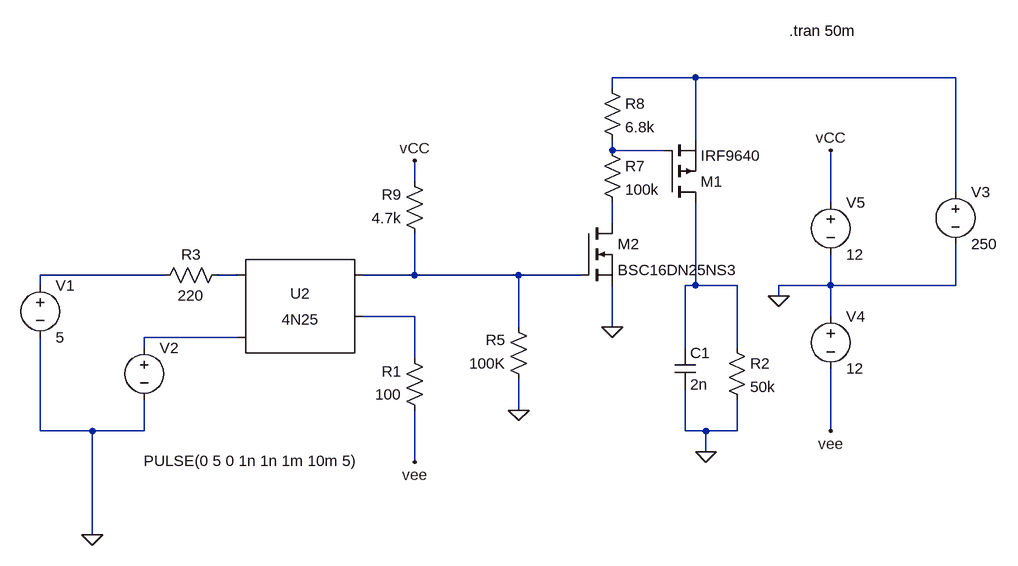
[diagram p0: schematic writePlateDriver.asc]
writePlateDriver.asc, the LTspice schematic file:
Version 4
SHEET 1 1400 848
WIRE 736 -64 608 -64
WIRE 1136 -64 736 -64
WIRE 608 -48 608 -64
WIRE 736 32 736 -64
WIRE 608 48 608 32
WIRE 688 48 608 48
WIRE 304 96 304 64
WIRE 1136 112 1136 -64
WIRE 944 128 944 48
WIRE 608 160 608 128
WIRE -80 240 -272 240
WIRE 32 240 0 240
WIRE 304 240 304 176
WIRE 304 240 224 240
WIRE 464 240 304 240
WIRE 560 240 464 240
WIRE -272 256 -272 240
WIRE 736 256 736 128
WIRE 736 256 720 256
WIRE 800 256 736 256
WIRE 944 256 944 208
WIRE 944 256 864 256
WIRE 1136 256 1136 192
WIRE 1136 256 944 256
WIRE 864 272 864 256
WIRE 304 304 224 304
WIRE 944 304 944 256
WIRE 464 320 464 240
WIRE 608 320 608 256
WIRE 32 336 -112 336
WIRE -112 352 -112 336
WIRE 720 352 720 256
WIRE 800 352 800 256
WIRE 304 368 304 304
WIRE 464 448 464 400
WIRE -272 480 -272 336
WIRE -192 480 -272 480
WIRE -112 480 -112 432
WIRE -112 480 -192 480
WIRE 720 480 720 416
WIRE 752 480 720 480
WIRE 800 480 800 432
WIRE 800 480 752 480
WIRE 944 480 944 384
WIRE 752 512 752 480
WIRE 304 528 304 448
WIRE -192 640 -192 480
FLAG 864 272 0
FLAG 944 480 vee
FLAG 944 48 vCC
FLAG 608 320 0
FLAG 752 512 0
FLAG 304 64 vCC
FLAG 304 528 vee
FLAG 464 448 0
FLAG -192 640 0
SYMBOL voltage -112 336 R0
WINDOW 3 -1 190 Left 2
SYMATTR Value PULSE(0 5 0 1n 1n 1m 10m 5)
SYMATTR InstName V2
SYMBOL res 16 224 R90
WINDOW 0 0 56 VBottom 2
WINDOW 3 32 56 VTop 2
SYMATTR InstName R3
SYMATTR Value 220
SYMBOL voltage 944 288 R0
SYMATTR InstName V4
SYMATTR Value 12
SYMBOL voltage 944 112 R0
SYMATTR InstName V5
SYMATTR Value 12
SYMATTR SpiceLine Rser=5
SYMBOL voltage 1136 96 R0
SYMATTR InstName V3
SYMATTR Value 250
SYMATTR SpiceLine Rser=5
SYMBOL nmos 560 160 R0
SYMATTR InstName M2
SYMATTR Value BSC16DN25NS3
SYMBOL res 592 32 R0
SYMATTR InstName R7
SYMATTR Value 100k
SYMBOL cap 704 352 R0
SYMATTR InstName C1
SYMATTR Value 2n
SYMBOL res 784 336 R0
SYMATTR InstName R2
SYMATTR Value 50k
SYMBOL res 592 -64 R0
SYMATTR InstName R8
SYMATTR Value 6.8k
SYMBOL pmos 688 128 M180
SYMATTR InstName M1
SYMATTR Value IRF9640
SYMBOL 4N25 128 304 R0
SYMATTR InstName U2
SYMBOL res 320 192 R180
WINDOW 0 36 76 Left 2
WINDOW 3 36 40 Left 2
SYMATTR InstName R9
SYMATTR Value 4.7k
SYMBOL res 320 464 R180
WINDOW 0 36 76 Left 2
WINDOW 3 36 40 Left 2
SYMATTR InstName R1
SYMATTR Value 100
SYMBOL res 480 416 R180
WINDOW 0 36 76 Left 2
WINDOW 3 36 40 Left 2
SYMATTR InstName R5
SYMATTR Value 100K
SYMBOL voltage -272 240 R0
SYMATTR InstName V1
SYMATTR Value 5
SYMATTR SpiceLine Rser=0
TEXT 880 -136 Left 2 !.tran 50m

The netlist it stands for:
* writePlateDriver.asc
V2 N009 0 PULSE(0 5 0 1n 1n 1m 10m 5)
R3 N005 N004 220
V4 0 vee 12
V5 vCC 0 12 Rser=5
V3 N001 0 250 Rser=5
M2 N003 N006 0 0 BSC16DN25NS3
R7 N002 N003 100k
C1 N007 0 2n
R2 N007 0 50k
R8 N001 N002 6.8k
M1 N007 N002 N001 N001 IRF9640
XU2 N005 N009 N006 N008 NC_01 4N25
R9 N006 vCC 4.7k
R1 vee N008 100
R5 0 N006 100K
V1 N004 0 5 Rser=0
.model NMOS NMOS
.model PMOS PMOS
.lib standard.mos
.tran 50m
.lib 4N25.sub
.backanno
.end